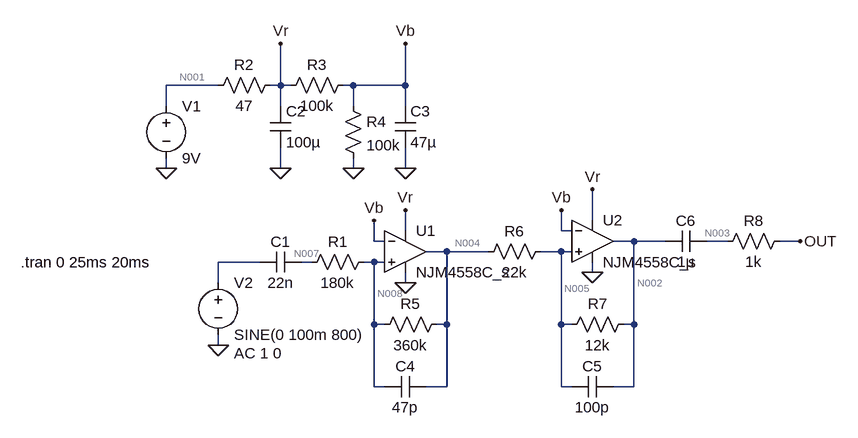
[diagram p0: schematic deepblue.asc]
deepblue.asc, the LTspice schematic file:
Version 4
SHEET 1 980 680
WIRE 16 -128 -64 -128
WIRE 112 -128 112 -192
WIRE 112 -128 96 -128
WIRE 128 -128 112 -128
WIRE 224 -128 208 -128
WIRE 304 -128 304 -192
WIRE 304 -128 224 -128
WIRE -64 -96 -64 -128
WIRE 112 -96 112 -128
WIRE 224 -96 224 -128
WIRE 304 -96 304 -128
WIRE -64 0 -64 -16
WIRE 112 0 112 -32
WIRE 224 0 224 -16
WIRE 304 0 304 -32
WIRE 592 80 592 32
WIRE 304 96 304 64
WIRE 544 96 544 64
WIRE 560 96 544 96
WIRE 256 112 256 80
WIRE 272 112 256 112
WIRE 656 112 624 112
WIRE 704 112 656 112
WIRE 800 112 768 112
WIRE 912 112 880 112
WIRE 368 128 336 128
WIRE 432 128 368 128
WIRE 544 128 512 128
WIRE 560 128 544 128
WIRE 80 144 16 144
WIRE 160 144 144 144
WIRE 256 144 240 144
WIRE 272 144 256 144
WIRE 592 160 592 144
WIRE 16 176 16 144
WIRE 304 176 304 160
WIRE 256 240 256 144
WIRE 272 240 256 240
WIRE 368 240 368 128
WIRE 368 240 352 240
WIRE 544 240 544 128
WIRE 560 240 544 240
WIRE 656 240 656 112
WIRE 656 240 640 240
WIRE 16 272 16 256
WIRE 256 336 256 240
WIRE 272 336 256 336
WIRE 368 336 368 240
WIRE 368 336 336 336
WIRE 544 336 544 240
WIRE 560 336 544 336
WIRE 656 336 656 240
WIRE 656 336 624 336
FLAG -64 0 0
FLAG 112 0 0
FLAG 224 0 0
FLAG 304 0 0
FLAG 112 -192 Vr
FLAG 304 -192 Vb
FLAG 256 80 Vb
FLAG 544 64 Vb
FLAG 912 112 OUT
FLAG 16 272 0
FLAG 304 176 0
FLAG 592 160 0
FLAG 304 64 Vr
FLAG 592 32 Vr
SYMBOL cap 144 128 R90
WINDOW 0 0 32 VBottom 2
WINDOW 3 32 32 VTop 2
SYMATTR InstName C1
SYMATTR Value 22n
SYMBOL res 256 128 R90
WINDOW 0 0 56 VBottom 2
WINDOW 3 32 56 VTop 2
SYMATTR InstName R1
SYMATTR Value 180k
SYMBOL Opamps\\NJM4558 304 64 R0
SYMATTR InstName U1
SYMATTR Value NJM4558C_s
SYMBOL Opamps\\NJM4558 592 48 R0
SYMATTR InstName U2
SYMATTR Value NJM4558C_s
SYMBOL voltage -64 -112 R0
WINDOW 123 0 0 Left 2
WINDOW 39 0 0 Left 2
SYMATTR InstName V1
SYMATTR Value 9V
SYMBOL res 112 -144 R90
WINDOW 0 0 56 VBottom 2
WINDOW 3 32 56 VTop 2
SYMATTR InstName R2
SYMATTR Value 47
SYMBOL cap 96 -96 R0
SYMATTR InstName C2
SYMATTR Value 100µ
SYMBOL res 224 -144 R90
WINDOW 0 0 56 VBottom 2
WINDOW 3 32 56 VTop 2
SYMATTR InstName R3
SYMATTR Value 100k
SYMBOL res 208 -112 R0
SYMATTR InstName R4
SYMATTR Value 100k
SYMBOL cap 288 -96 R0
SYMATTR InstName C3
SYMATTR Value 47µ
SYMBOL voltage 16 160 R0
WINDOW 123 24 124 Left 2
WINDOW 39 0 0 Left 2
SYMATTR InstName V2
SYMATTR Value SINE(0 100m 800)
SYMATTR Value2 AC 1 0
SYMBOL res 368 224 R90
WINDOW 0 0 56 VBottom 2
WINDOW 3 32 56 VTop 2
SYMATTR InstName R5
SYMATTR Value 360k
SYMBOL cap 336 320 R90
WINDOW 0 0 32 VBottom 2
WINDOW 3 32 32 VTop 2
SYMATTR InstName C4
SYMATTR Value 47p
SYMBOL res 528 112 R90
WINDOW 0 0 56 VBottom 2
WINDOW 3 32 56 VTop 2
SYMATTR InstName R6
SYMATTR Value 22k
SYMBOL res 656 224 R90
WINDOW 0 0 56 VBottom 2
WINDOW 3 32 56 VTop 2
SYMATTR InstName R7
SYMATTR Value 12k
SYMBOL cap 624 320 R90
WINDOW 0 0 32 VBottom 2
WINDOW 3 32 32 VTop 2
SYMATTR InstName C5
SYMATTR Value 100p
SYMBOL cap 768 96 R90
WINDOW 0 0 32 VBottom 2
WINDOW 3 32 32 VTop 2
SYMATTR InstName C6
SYMATTR Value 1µ
SYMBOL res 896 96 R90
WINDOW 0 0 56 VBottom 2
WINDOW 3 32 56 VTop 2
SYMATTR InstName R8
SYMATTR Value 1k
TEXT -288 144 Left 2 !.tran 0 25ms 20ms

The netlist it stands for:
* deepblue.asc
C1 N007 N006 22n
R1 N008 N007 180k
XU1 N008 Vb Vr 0 N004 NJM4558C_s  ; pins In+ In- V+ V- OUT
XU2 N005 Vb Vr 0 N002 NJM4558C_s  ; pins In+ In- V+ V- OUT
V1 N001 0 9V
R2 Vr N001 47
C2 Vr 0 100µ
R3 Vb Vr 100k
R4 Vb 0 100k
C3 Vb 0 47µ
V2 N006 0 SINE(0 100m 800) AC 1 0
R5 N004 N008 360k
C4 N004 N008 47p
R6 N005 N004 22k
R7 N002 N005 12k
C5 N002 N005 100p
C6 N003 N002 1µ
R8 OUT N003 1k
.tran 0 25ms 20ms
.backanno
.end

* Results of the author's LTspice run, read from the files saved beside the schematic
* Operating Point, zero values left out:
*   V(n007) = 4.203 V
*   V(n008) = 4.203 V
*   V(n004) = 4.194 V
*   V(vr) = 8.404 V
*   V(vb) = 4.204 V
*   V(n002) = 4.209 V
*   V(n005) = 4.203 V
*   V(n001) = 9 V
*   V(n003) = 4.209 µV
*   V(out) = 4.209 µV
*   I(R7) = 421 nA
*   I(R6) = 448.4 nA
*   I(R5) = -27.4 nA
*   I(R4) = 42.04 µA
*   I(R3) = -42 µA
*   I(R2) = -12.69 mA
*   I(V1) = -12.69 mA
*   Ix(u1:1) = -22.41 nA
*   Ix(u1:2) = -27.4 nA
*   Ix(u1:3) = 6.325 mA
*   Ix(u1:4) = -6.319 mA
*   Ix(u1:5) = 475.8 nA
*   Ix(u2:1) = -22.41 nA
*   Ix(u2:2) = -27.4 nA
*   Ix(u2:3) = 6.325 mA
*   Ix(u2:4) = -6.319 mA
*   Ix(u2:5) = -421 nA
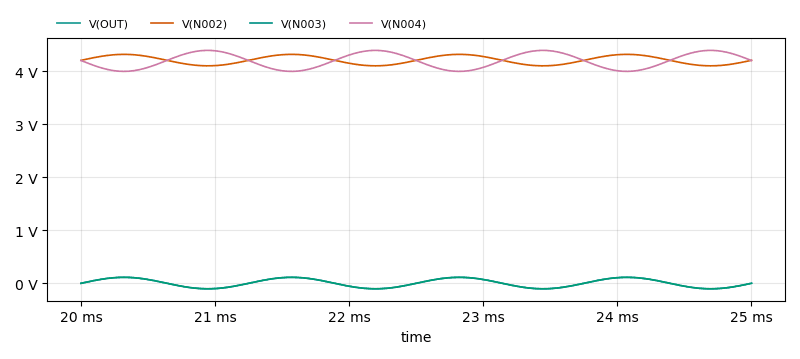
[diagram p1: Transient Analysis of deepblue.asc, plotted from the saved traces]
* Transient Analysis, 1 run:
*   V(OUT): min -108.3 mV, max 108.2 mV, average -17.45 µV, rms 76.57 mV, last -4.546 mV
*   V(N002): min 4.1 V, max 4.317 V, average 4.209 V, rms 4.209 V, last 4.204 V
*   V(N003): min -108.3 mV, max 108.2 mV, average -17.45 µV, rms 76.57 mV, last -4.546 mV
*   V(N004): min 3.995 V, max 4.392 V, average 4.194 V, rms 4.196 V, last 4.201 V